# Altium schematic sheet L293DD.SchDoc
size A
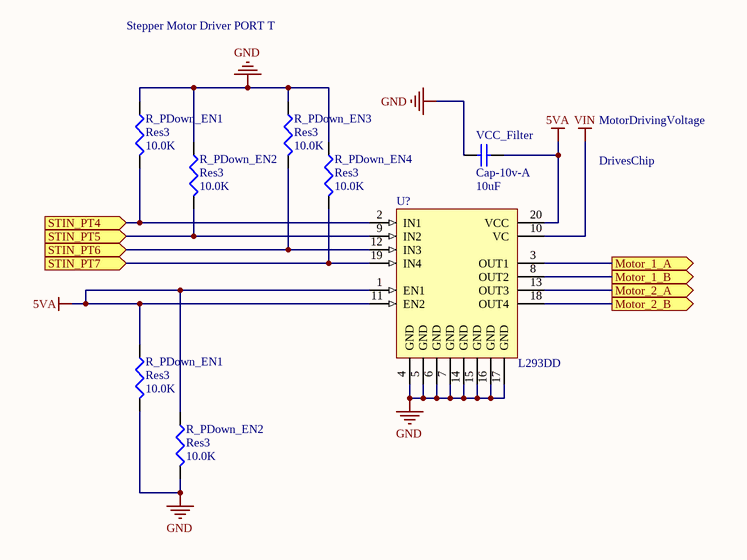
[diagram p0: L293DD.SchDoc]

## Parts
(Parts that share a designator on the sheet are numbered #1, #2 ... from top to bottom, then left to right.)
R_PDown_EN1#1  Res3  value 10.0K  [RESC2112X05M]
R_PDown_EN1#2  Res3  value 10.0K  [RESC2112X05M]
R_PDown_EN2#1  Res3  value 10.0K  [RESC2112X05M]
R_PDown_EN2#2  Res3  value 10.0K  [RESC2112X05M]
R_PDown_EN3  Res3  value 10.0K  [RESC2112X05M]
R_PDown_EN4  Res3  value 10.0K  [RESC2112X05M]
U?  L293DD  [SO20_N]
VCC_Filter  Cap-10v-A  value 10uF  [C1210]

## Ports
Motor_1_A (out), Motor_1_B (out), Motor_2_A (out), Motor_2_B (out), STIN_PT4 (in), STIN_PT5 (in), STIN_PT6 (in), STIN_PT7 (in)

## Nets
5VA: R_PDown_EN1#2.1 R_PDown_EN2#2.1 U?.1(EN1) U?.11(EN2) U?.20(VCC) VCC_Filter.1
GND: R_PDown_EN1#1.1 R_PDown_EN1#2.2 R_PDown_EN2#1.1 R_PDown_EN2#2.2 R_PDown_EN3.1 R_PDown_EN4.1 U?.4(GND) U?.5(GND) U?.6(GND) U?.7(GND) U?.14(GND) U?.15(GND) U?.16(GND) U?.17(GND) VCC_Filter.2
VIN: U?.10(VC)
Motor_1_A: U?.3(OUT1) ; port Motor_1_A
Motor_1_B: U?.8(OUT2) ; port Motor_1_B
Motor_2_A: U?.13(OUT3) ; port Motor_2_A
Motor_2_B: U?.18(OUT4) ; port Motor_2_B
STIN_PT4: R_PDown_EN1#1.2 U?.2(IN1) ; port STIN_PT4
STIN_PT5: R_PDown_EN2#1.2 U?.9(IN2) ; port STIN_PT5
STIN_PT6: R_PDown_EN3.2 U?.12(IN3) ; port STIN_PT6
STIN_PT7: R_PDown_EN4.2 U?.19(IN4) ; port STIN_PT7

## Notes on the sheet
- Stepper Motor Driver PORT T
- MotorDrivingVoltage
- DrivesChip

## Library data of the parts
R_PDown_EN1#1 R_PDown_EN1#2 R_PDown_EN2#1 R_PDown_EN2#2 R_PDown_EN3 R_PDown_EN4 = Resistor_10.0K: RES SMD 10.0K OHM 1% 1/8W 0805; MPN: CRCW080510K0FKEA; PN: 541-10.0KCCT-ND; Name: Resistor_10.0K; URL: http://www.digikey.ca/product-detail/en/CRCW080510K0FKEA/541-10.0KCCT-ND
U? = L293DD: Push-Pull Four Channel Driver With Diode; PN: 497-2937-1-ND; Published: 8-Jun-2000; LatestRevisionDate: 13-Apr-2006; LatestRevisionNote: IPC-7351 Footprint Added.; DatasheetVersion: Jun-1996; PackageVersion: Jul-2001; PackageReference: SO20; Publisher: Altium Limited; PackageDescription: 20-Pin Plastic Small Outline Integrated Circuit 1.27 mm Pitch; Code_JEDEC: MS-013-AC; Code_IPC: SOIC127P1030-20; ComponentLink1Description: Manufacturer Link; ComponentLink1URL: http://www.st.com/; ComponentLink2Description: Datasheet; ComponentLink2URL: http://www.st.com/stonline/products/literature/ds/1330/l293d.pdf; URL: http://www.digikey.ca/product-detail/en/L293DD013TR/497-2937-1-ND/634902
VCC_Filter = Cap: Capacitor; Published: 8-Jun-2000; LatestRevisionDate: 17-Jul-2002; LatestRevisionNote: Re-released for DXP Platform.; PackageReference: RAD-0.3; Publisher: Altium Limited; PackageDescription: Radial Cap, Thru-Hole; 2 Leads; 0.3 in Pin Spacing